# EAGLE design standalone (EAGLE 9.0.1)
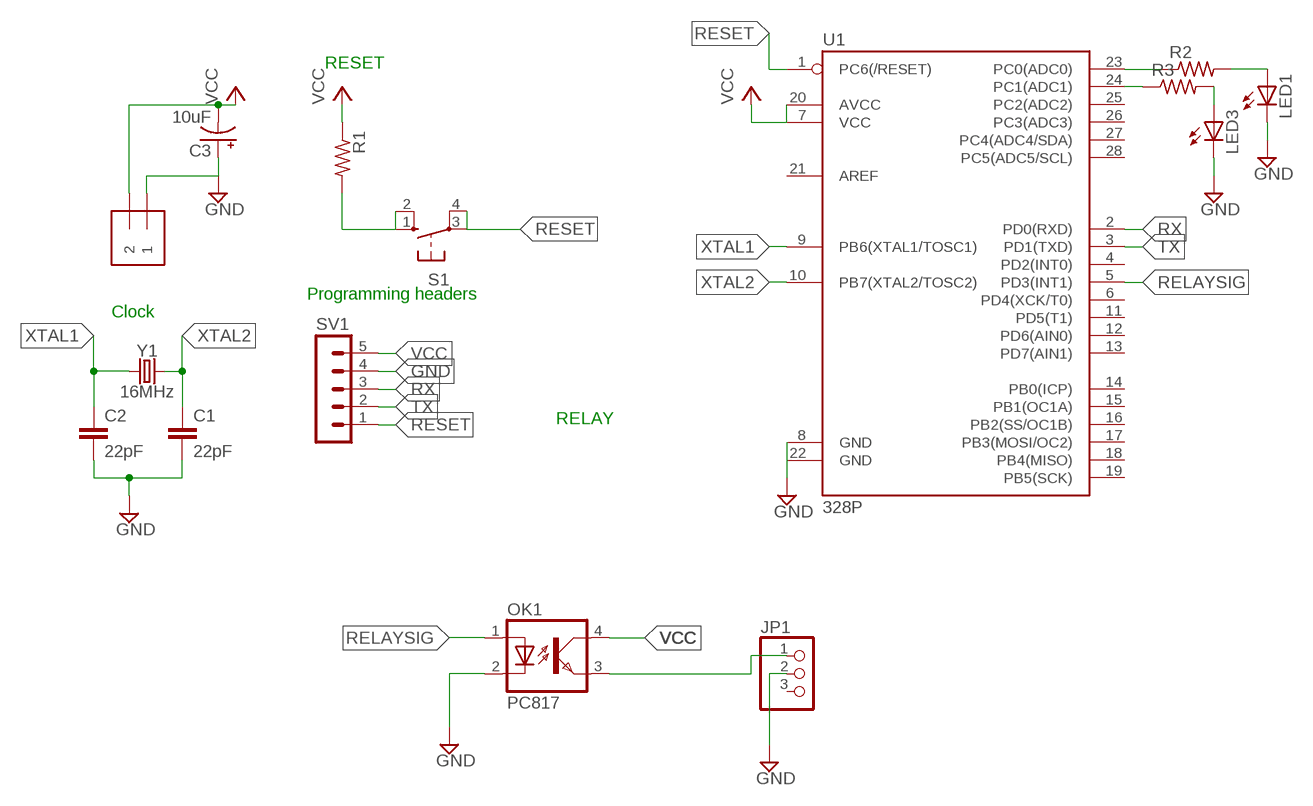
[diagram p0: schematic, sheet 1]

## Parts
C1  22pF  22PF-PTH-2.54MM-200V-5%  [CAP-PTH-2.54]
C2  22pF  22PF-PTH-2.54MM-200V-5%  [CAP-PTH-2.54]
C3  10uF  10UF-POLAR-RADIAL-2.5MM-25V-20%  [CPOL-RADIAL-2.5MM-5MM]
J1  1X2-3.5MM  [1X2-3.5MM]
JP1  PINHD-1X3  [1X03]
LED1  LED5MM  [LED5MM]
LED3  LED5MM  [LED5MM]
OK1  PC817  [DIL04]
R1  R-US_0617/5V  [0617V]
R2  R-US_0204/5  [0204/5]
R3  R-US_0204/7  [0204/7]
S1  10-XX  [B3F-10XX]
SV1  MA05-1  [MA05-1]
U1  328P  ATMEGA328P_PDIP  [DIP28]
Y1  16MHz  CRYSTAL-16MHZPTH-HC49US  [HC49US]

## Nets
GND: C1.2 C2.2 C3.1(+) J1.1 JP1.2 LED1.K(C) LED3.K(C) OK1.2(C) SV1.4 U1.8(GND) U1.22(GND)
N$1: LED3.A R3.2
N$2: JP1.1 OK1.3(EMIT)
N$3: R2.1 U1.23(PC0(ADC0))
N$4: LED1.A R2.2
N$5: R3.1 U1.24(PC1(ADC1))
RELAYSIG: OK1.1(A) U1.5(PD3(INT1))
RESET: R1.2 S1.1(S) S1.2(S1) S1.3(P) S1.4(P1) SV1.1 U1.1(PC6(/RESET))
RX: SV1.3 U1.2(PD0(RXD))
TX: SV1.2 U1.3(PD1(TXD))
VCC: C3.2(-) J1.2 OK1.4(COL) R1.1 SV1.5 U1.7(VCC) U1.20(AVCC)
XTAL1: C2.1 U1.9(PB6(XTAL1/TOSC1)) Y1.1
XTAL2: C1.1 U1.10(PB7(XTAL2/TOSC2)) Y1.2
Unconnected: JP1.3 U1.4(PD2(INT0)) U1.6(PD4(XCK/T0)) U1.11(PD5(T1)) U1.12(PD6(AIN0)) U1.13(PD7(AIN1)) U1.14(PB0(ICP)) U1.15(PB1(OC1A)) U1.16(PB2(SS/OC1B)) U1.17(PB3(MOSI/OC2)) U1.18(PB4(MISO)) U1.19(PB5(SCK)) U1.21(AREF) U1.25(PC2(ADC2)) U1.26(PC3(ADC3)) U1.27(PC4(ADC4/SDA)) U1.28(PC5(ADC5/SCL))

## Notes on the sheet
- RESET
- Programming headers
- Clock
- RELAY

## Library data of the parts
C1 C2 = SparkFun-Capacitors:22PF: 22pF ceramic capacitors A capacitor is a passive two-terminal electrical component used to store electrical energy temporarily in an electric field.; PROD_ID: CAP-09128
C3 = SparkFun-Capacitors:10UF-POLAR: 10.0µF polarized capacitors A capacitor is a passive two-terminal electrical component used to store electrical energy temporarily in an electric field.; PROD_ID: CAP-08440
J1 = adafruit:1X2: 3.5mm Terminal block http://www.ladyada.net/library/pcb/eaglelibrary.html
JP1 = adafruit:PINHD-1X3: PIN HEADER
LED1 LED3 = adafruit:LED: LED OSRAM: - CHIPLED LG R971, LG N971, LY N971, LG Q971, LY Q971, LO R971, LY R971 LH N974, LH R974 LS Q976, LO Q976, LY Q976 LO Q996 - Hyper CHIPLED LW Q18S LB Q993, LB Q99A, LB R99A - SideLED LS A670, LO A670, LY A670, LG A670, LP A670 LB A673, LV A673, LT A673, LW A673 LH A674 LY A675 LS A676, LA A676, LO A676, LY A676, LW A676 LS A679, LY A679, LG A679 - Hyper Micro SIDELED® LS Y876, LA Y876, LO Y876, LY Y876 LT Y87S - SmartLED LW L88C, LW L88S LB L89C, LB L89S, LG L890 LS L89K, LO L89K, LY L89K LS L896, LA L896, LO L896, LY L896 - TOPLED LS T670, LO T670, LY T670, LG T670, LP T670 LSG T670, LSP T670, LSY T670, LOP T670, LYG T670 LG T671, LOG T671, LSG T671 LB T673, LV T673, LT T673, LW T673 LH T674 LS T676, LA T676, LO T676, LY T676, LB T676, LH T676, LSB T676, LW T676 LB T67C, LV T67C, LT T67C, LS T67K, LO T67K, LY T67K, LW E67C LS E67B, LA E67B, LO E67B, LY E67B, LB E67C, LV E67C, LT E67C LW T67C LS T679, LY T679, LG T679 LS T770, LO T770, LY T770, LG T770, LP T770 LB T773, LV T773, LT T773, LW T773 LH T774 LS E675, LA E675, LY E675, LS T675 LS T776, LA T776, LO T776, LY T776, LB T776 LHGB T686 LT T68C, LB T68C - Hyper Mini TOPLED® LB M676 - Mini TOPLED Santana® LG M470 LS M47K, LO M47K, LY M47K Source: http://www.osram.convergy.de/
OK1 = optocoupler:PC817: SHARP OPTO COUPLER; MPN: PC817X4J000F; OC_FARNELL: 9707727; OC_NEWARK: 97K7059
R1 R3 = adafruit:R-US_: RESISTOR, American symbol
R2 = resistor:R-US_: RESISTOR, American symbol
S1 = switch-omron:10-XX: OMRON SWITCH; MPN: B3F-1000; OC_FARNELL: 176432; OC_NEWARK: 36M3542
SV1 = con-lstb:MA05-1: PIN HEADER; OC_FARNELL: unknown; OC_NEWARK: unknown
U1 = SparkFun-IC-Microcontroller:ATMEGA328P_PDIP: Atmel 328P Through hole ATMEGA328P uC used in the Arduino 32kb flash, 1k EEPROM, 2k SRAM Datasheet <http://www.sparkfun.com/datasheets/Components/SMD/ATMega328.pdf> SparkFun Products Storefront component: AVR 28 Pin 20MHz 32K 6A/D - ATMega328P <https://www.sparkfun.com/products/9061> (COM-09061) SparkFun Simon Says - Through-Hole Soldering Kit <https://www.sparkfun.com/products/10547> (KIT-10547) SparkFun Learn to Solder - Simon Says <https://www.sparkfun.com/products/13708> (KIT-13708) SparkFun BigTime Watch Kit <https://www.sparkfun.com/products/11734> (KIT-11734) SparkFun ClockIt <https://www.sparkfun.com/products/10930> (KIT-10930) SparkFun Serial Enabled LCD Kit <https://www.sparkfun.com/products/10097> (LCD-10097) SparkFun Simon Tilts - Through Hole Soldering Kit <https://www.sparkfun.com/products/12634> (KIT-12634) SparkFun Frequency Counter Kit <https://www.sparkfun.com/products/10140> (KIT-10140) FabFM Radio Kit <https://www.sparkfun.com/products/11043> (KIT-11043) SparkFun Binary Blaster Kit <https://www.sparkfun.com/products/12037> (KIT-12037) SparkFun Metro-Gnome <https://www.sparkfun.com/products/9236> (KIT-09236) ATmega328 with Arduino Optiboot (Uno) <https://www.sparkfun.com/products/10524> (DEV-10524); PROD_ID: IC-09136
Y1 = SparkFun-Clocks:CRYSTAL-16MHZ: 16MHz Crystal Digikey Example <http://www.digikey.com/product-search/en?keywords=535-9122-1-ND> Frequency: 16MHz Frequency Stability: ±50ppm Frequency Tolerance: ±20ppm Load Capacitance: 18pF SparkFun Products: Pro Micro -5V/16MHz <https://www.sparkfun.com/products/12640> SparkFun Serial Enabled LCD Kit <https://www.sparkfun.com/products/10097>; PROD_ID: XTAL-08181; SF_ID: COM-00536

## Board
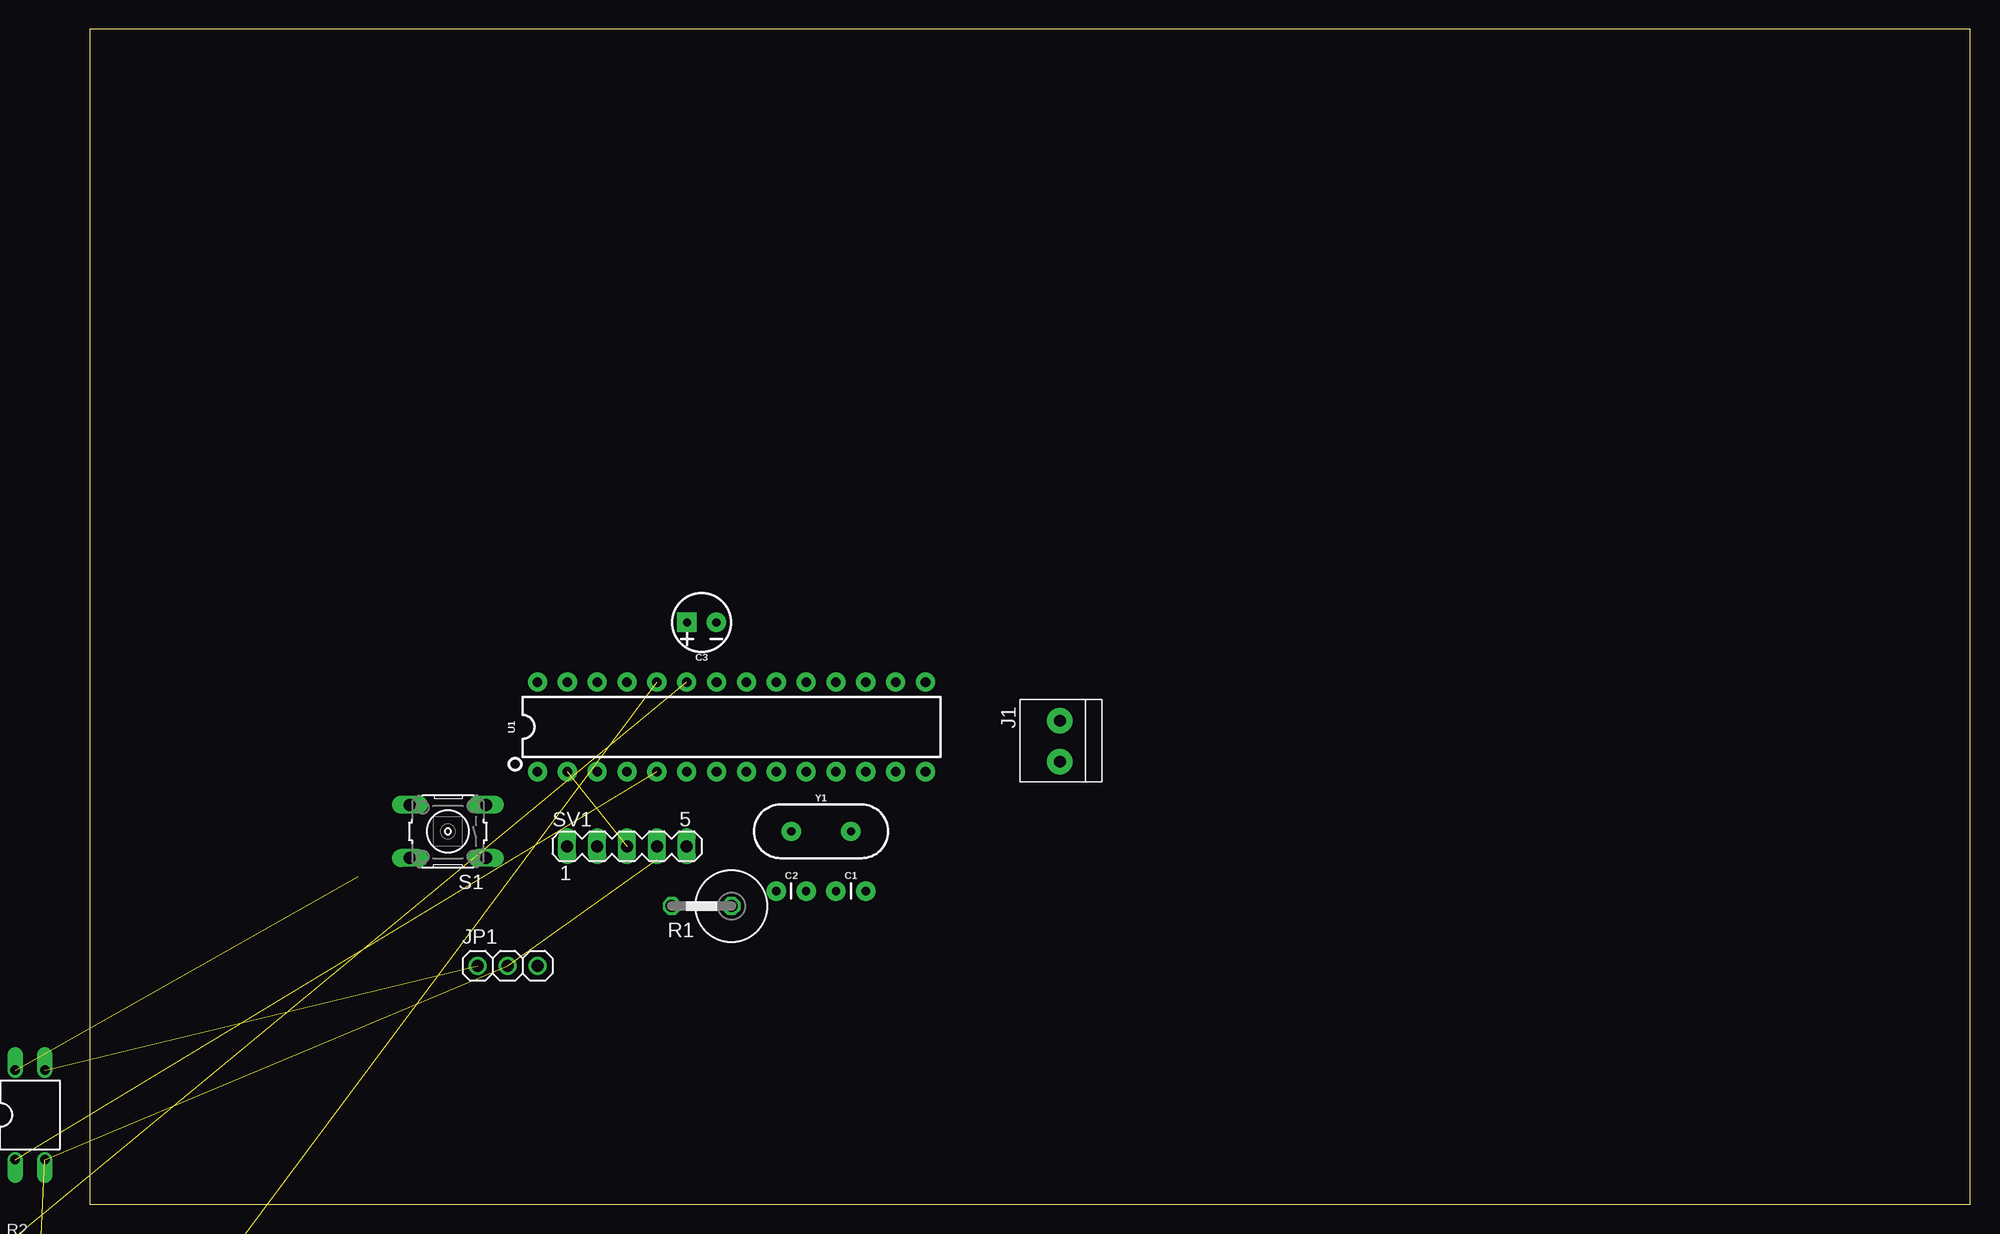
[diagram p1: board, top side]
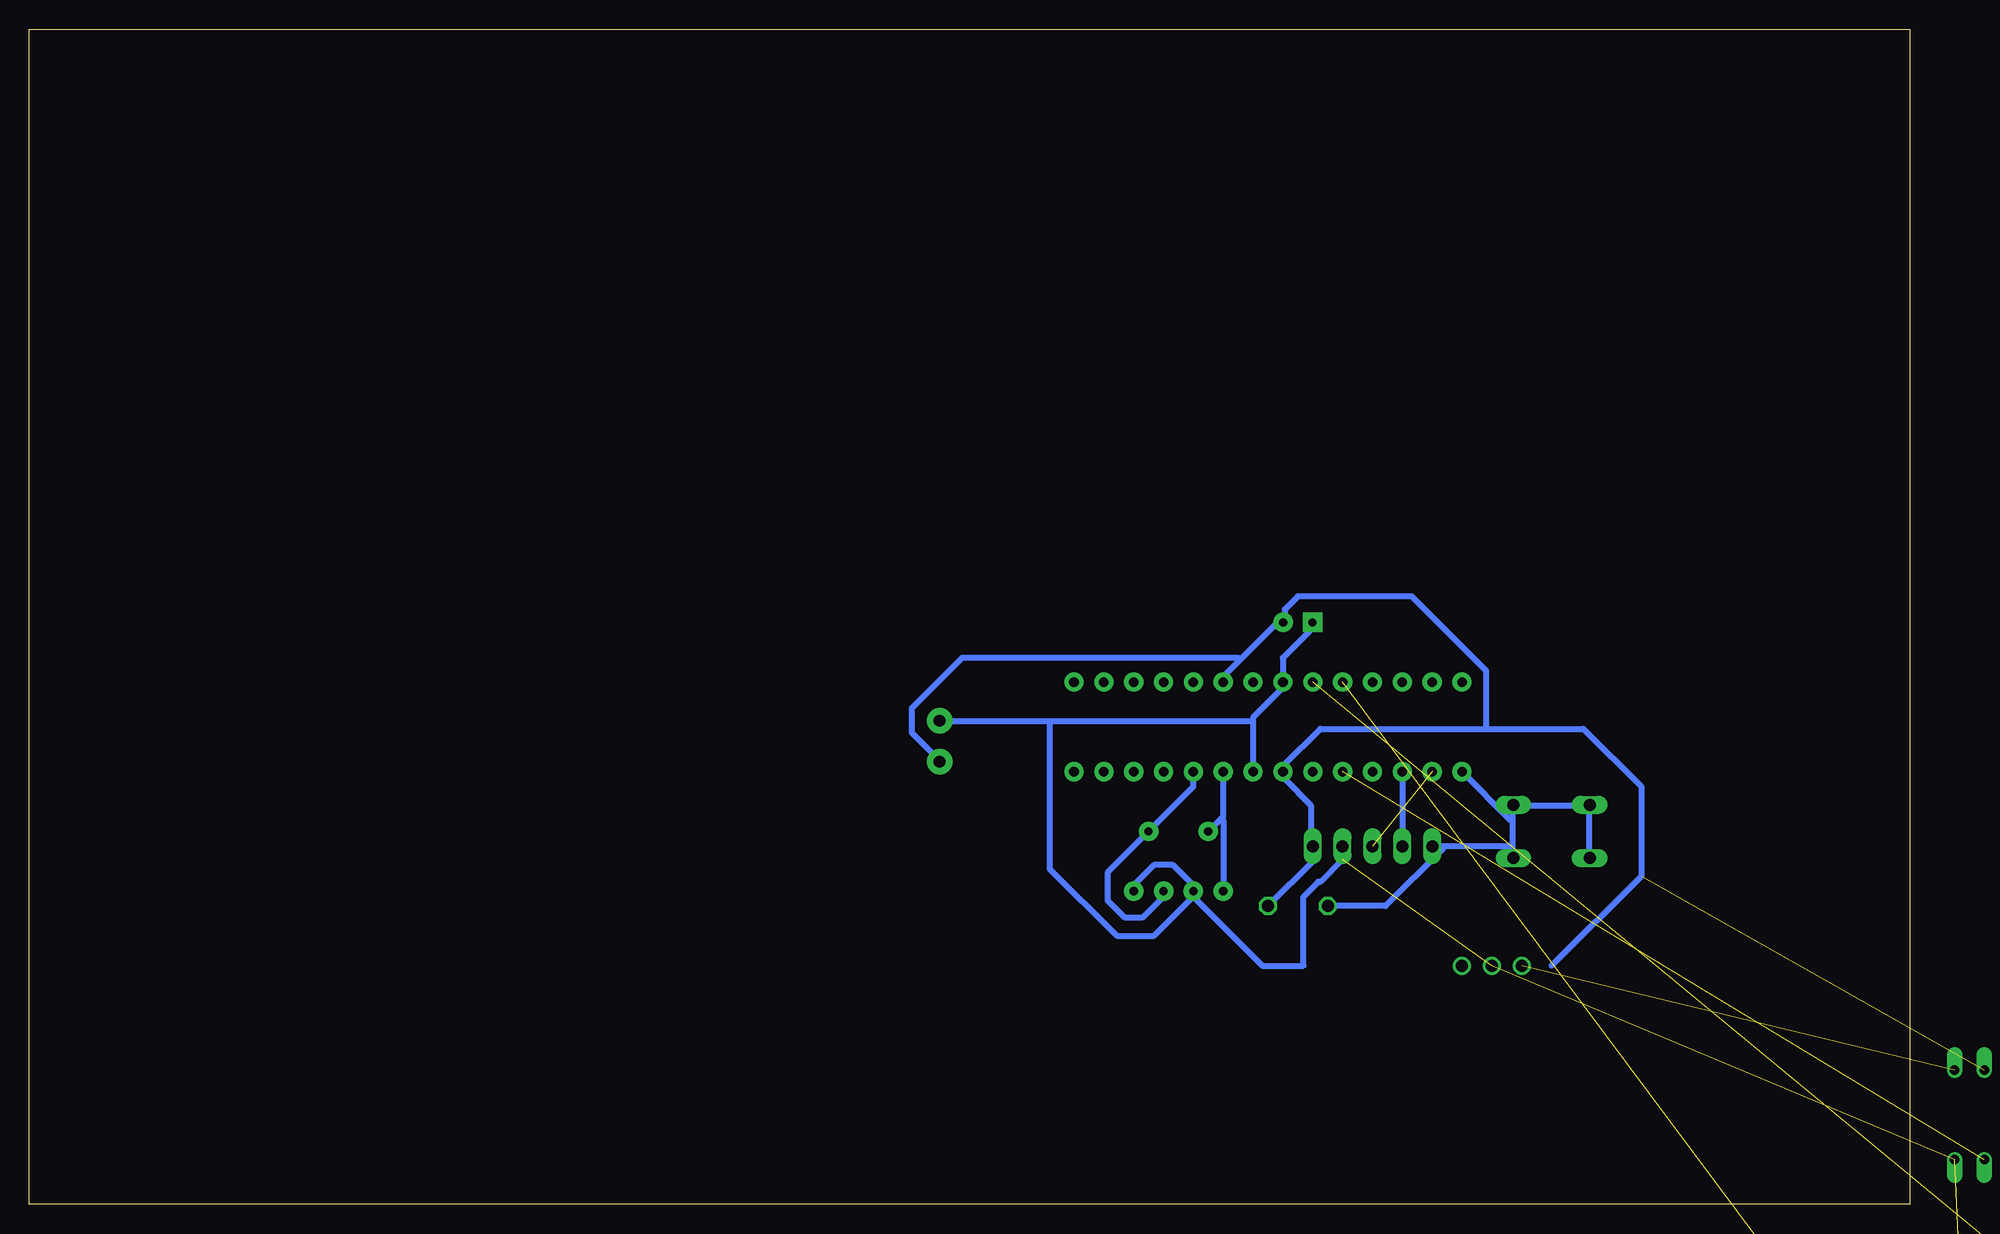
[diagram p2: board, bottom side, seen from below]

Size 160 x 100 mm. Coordinates in mm from the lower left corner, seen from the top.
Outline: 0,0 160,0 160,100 0,100 0,0
Copper layers (1*16): Top 0.035mm / dielectric 1.5mm / Bottom 0.035mm
Design rules "default *": minimum track width 0.5mm, minimum drill 0.35mm, track to track 1mm, track to pad 1mm, pad to pad 1mm, via to via 1mm, smd to smd 6mil, copper to edge 1mm, drill to drill 1mm, minimum pad ring 10mil, minimum via ring 8mil, stop-mask expansion 4mil, vias tented up to drill 0mil, thermal gap 10mil

### Footprints (pad centres in the part's own frame; a part is rotated, then mirrored left to right if it is on the bottom)
CAP-PTH-2.54 = drill 0.7 pad 1.651: 1 -1.27,0; 2 1.27,0
CPOL-RADIAL-2.5MM-5MM = drill 0.7 pad 1.651 square: 1 1.25,0 | drill 0.7 pad 1.651: 2 -1.25,0
1X2-3.5MM = drill 1 pad 2.184: 1 1.8,0; 2 -1.7,0
1X03 = drill 1.016: 1 -2.54,0; 2 0,0; 3 2.54,0
LED5MM = drill 0.813 pad 1.676 octagon: A -1.27,0; K 1.27,0
DIL04 = drill 0.813 offset: 1 -1.27,-3.81; 2 1.27,-3.81; 3 1.27,3.81; 4 -1.27,3.81
0617V = drill 1.016 octagon: 1 -2.54,0; 2 2.54,0
0204/5 = drill 0.813 octagon: 1 -2.54,0; 2 2.54,0
0204/7 = drill 0.813 pad 1.676 octagon: 1 -3.81,0; 2 3.81,0
B3F-10XX = drill 1.016 long: 1 -3.251,2.261; 2 3.251,2.261; 3 -3.251,-2.261; 4 3.251,-2.261
MA05-1 = drill 1.016 long: 1 -5.08,0; 2 -2.54,0; 3 0,0; 4 2.54,0; 5 5.08,0
DIP28 = drill 0.813 pad 1.626: 1 -16.51,-3.81; 2 -13.97,-3.81; 3 -11.43,-3.81; 4 -8.89,-3.81; 5 -6.35,-3.81; 6 -3.81,-3.81; 7 -1.27,-3.81; 8 1.27,-3.81; 9 3.81,-3.81; 10 6.35,-3.81; 11 8.89,-3.81; 12 11.43,-3.81; 13 13.97,-3.81; 14 16.51,-3.81; 15 16.51,3.81; 16 13.97,3.81; 17 11.43,3.81; 18 8.89,3.81; 19 6.35,3.81; 20 3.81,3.81; 21 1.27,3.81; 22 -1.27,3.81; 23 -3.81,3.81; 24 -6.35,3.81; 25 -8.89,3.81; 26 -11.43,3.81; 27 -13.97,3.81; 28 -16.51,3.81
HC49US = drill 0.7 pad 1.651: 1 -2.54,0; 2 2.54,0

### Placement (x,y rotation side)
C1  64.77,26.67 0 top
C2  59.69,26.67 0 top
C3  52.07,49.53 180 top
J1  82.55,39.37 90 top
JP1  35.56,20.32 0 top
LED1  -6.35,-35.56 0 top  (outside the outline)
LED3  -6.35,-24.13 0 top  (outside the outline)
OK1  -5.08,7.62 0 top  (outside the outline)
R1  52.07,25.4 180 top
R2  -5.08,-3.81 0 top  (outside the outline)
R3  -3.81,-30.48 0 top  (outside the outline)
S1  30.48,31.75 180 top
SV1  45.72,30.48 0 top
U1  54.61,40.64 0 top
Y1  62.23,31.75 0 top

### Tracks (layer width: path | path; a pad name or v marks a point on that pad's centre or on a via)
GND  (4 unrouted)
  Bottom 0.5: C2.2 60.96,26.19 55.09,20.32 51.59,20.32 51.59,26.19 50.32,27.46 50.16,27.46 48.26,29.37 SV1.4 | C1.2 66.04,27.15 64.29,28.89 62.71,28.89 61.12,27.3 61.12,26.83 C2.2 | C3.1 50.96,49.53 50.96,48.9 53.34,46.51 U1.22 53.5,44.29 53.5,43.81 55.88,41.43 55.88,41.12 | 55.88,41.12 U1.8 | 55.88,41.12 73.18,41.12 | 73.18,41.12 82.55,41.12 J1.1 | 73.18,41.12 73.18,28.57 67.47,22.86 64.29,22.86 61.12,26.04 C2.2
N$1  (1 unrouted)
N$2  (1 unrouted)
N$3  (1 unrouted)
N$4  (1 unrouted)
N$5  (1 unrouted)
RELAYSIG  (1 unrouted)
RESET
  Bottom 0.5: S1.2 27.3,29.53 27.3,33.97 S1.4 27.46,33.97 33.5,33.97 S1.3 33.81,33.97 33.81,32.7 | 33.81,32.7 33.81,30.48 | 33.81,30.48 33.81,29.53 S1.1 | 33.81,30.48 39.69,30.48 | 39.69,30.48 SV1.1 | R1.2 44.61,25.4 39.69,30.32 39.69,30.48 | U1.1 33.97,32.7 33.81,32.7
RX  (1 unrouted)
TX
  Bottom 0.5: U1.3 SV1.2
VCC  (1 unrouted)
  Bottom 0.5: U1.20 58.42,44.93 56.99,46.35 | 56.99,46.35 53.82,49.53 C3.2 53.18,49.69 53.18,50.64 52.07,51.75 42.39,51.75 36.04,45.4 36.04,40.48 | J1.2 82.55,37.78 84.93,40.16 84.93,42.23 80.64,46.51 57.15,46.51 56.99,46.35 | R1.1 50.8,29.21 SV1.5 50.96,30.64 50.96,33.97 53.18,36.2 53.18,36.67 U1.7 53.34,37.31 50.16,40.48 36.04,40.48 | 30.48,20.32 22.86,27.94 22.86,35.56 27.78,40.48 36.04,40.48
XTAL1
  Bottom 0.5: U1.9 58.42,33.02 58.58,32.86 | Y1.1 58.58,32.86 | C2.1 58.42,32.7 58.58,32.86
XTAL2
  Bottom 0.5: U1.10 60.96,35.56 Y1.2 68.26,28.26 68.26,25.88 66.83,24.45 65.25,24.45 63.5,26.19 C1.1